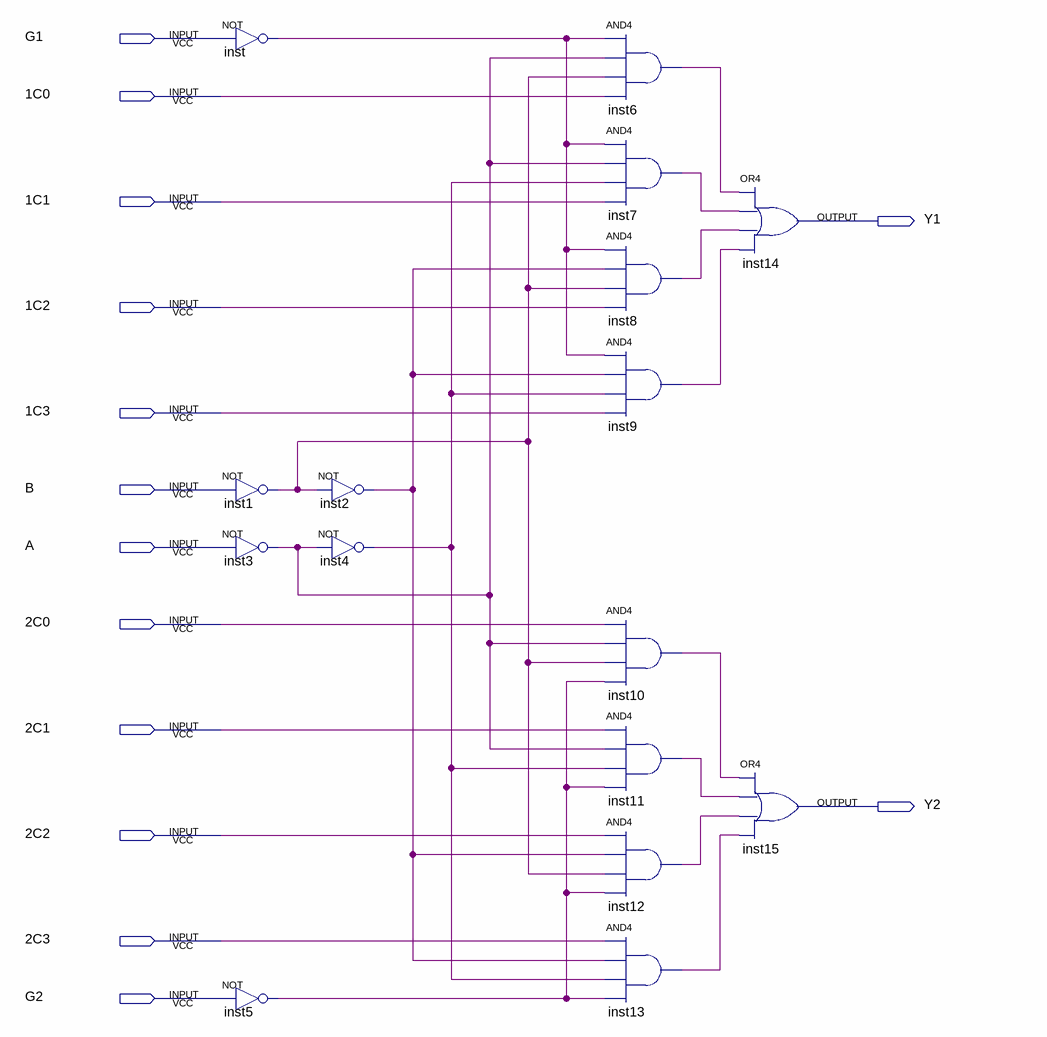
[diagram p0: schematic sheet]
// Quartus schematic ci_74LS153.bdf as structural Verilog: 16 symbols, 14 pins
module ci_74LS153 (
  input  G1,
  input  \1C0 ,
  input  \1C1 ,
  input  \1C2 ,
  input  \1C3 ,
  input  B,
  input  A,
  input  \2C0 ,
  input  \2C1 ,
  input  \2C2 ,
  input  \2C3 ,
  input  G2,
  output Y1,
  output Y2
);

  wire inst1_out, inst2_out, inst3_out, inst4_out, inst5_out, inst6_out, inst7_out, inst8_out, inst9_out,
       inst10_out, inst11_out, inst12_out, inst13_out, inst_out;

  not inst (inst_out, G1);
  not inst1 (inst1_out, B);
  not inst3 (inst3_out, A);
  not inst5 (inst5_out, G2);
  not inst2 (inst2_out, inst1_out);
  not inst4 (inst4_out, inst3_out);
  and inst6 (inst6_out, inst_out, inst3_out, inst1_out, \1C0 );
  and inst7 (inst7_out, inst_out, inst3_out, inst4_out, \1C1 );
  and inst8 (inst8_out, inst_out, inst2_out, inst1_out, \1C2 );
  and inst9 (inst9_out, inst_out, inst2_out, inst4_out, \1C3 );
  and inst10 (inst10_out, \2C0 , inst3_out, inst1_out, inst5_out);
  and inst11 (inst11_out, \2C1 , inst3_out, inst4_out, inst5_out);
  and inst12 (inst12_out, \2C2 , inst2_out, inst1_out, inst5_out);
  and inst13 (inst13_out, \2C3 , inst2_out, inst4_out, inst5_out);
  or inst14 (Y1, inst6_out, inst7_out, inst8_out, inst9_out);
  or inst15 (Y2, inst10_out, inst11_out, inst12_out, inst13_out);
endmodule
